# EAGLE schematic 202405272 (EAGLE 6.6.0)

## Sheet 1 of 3
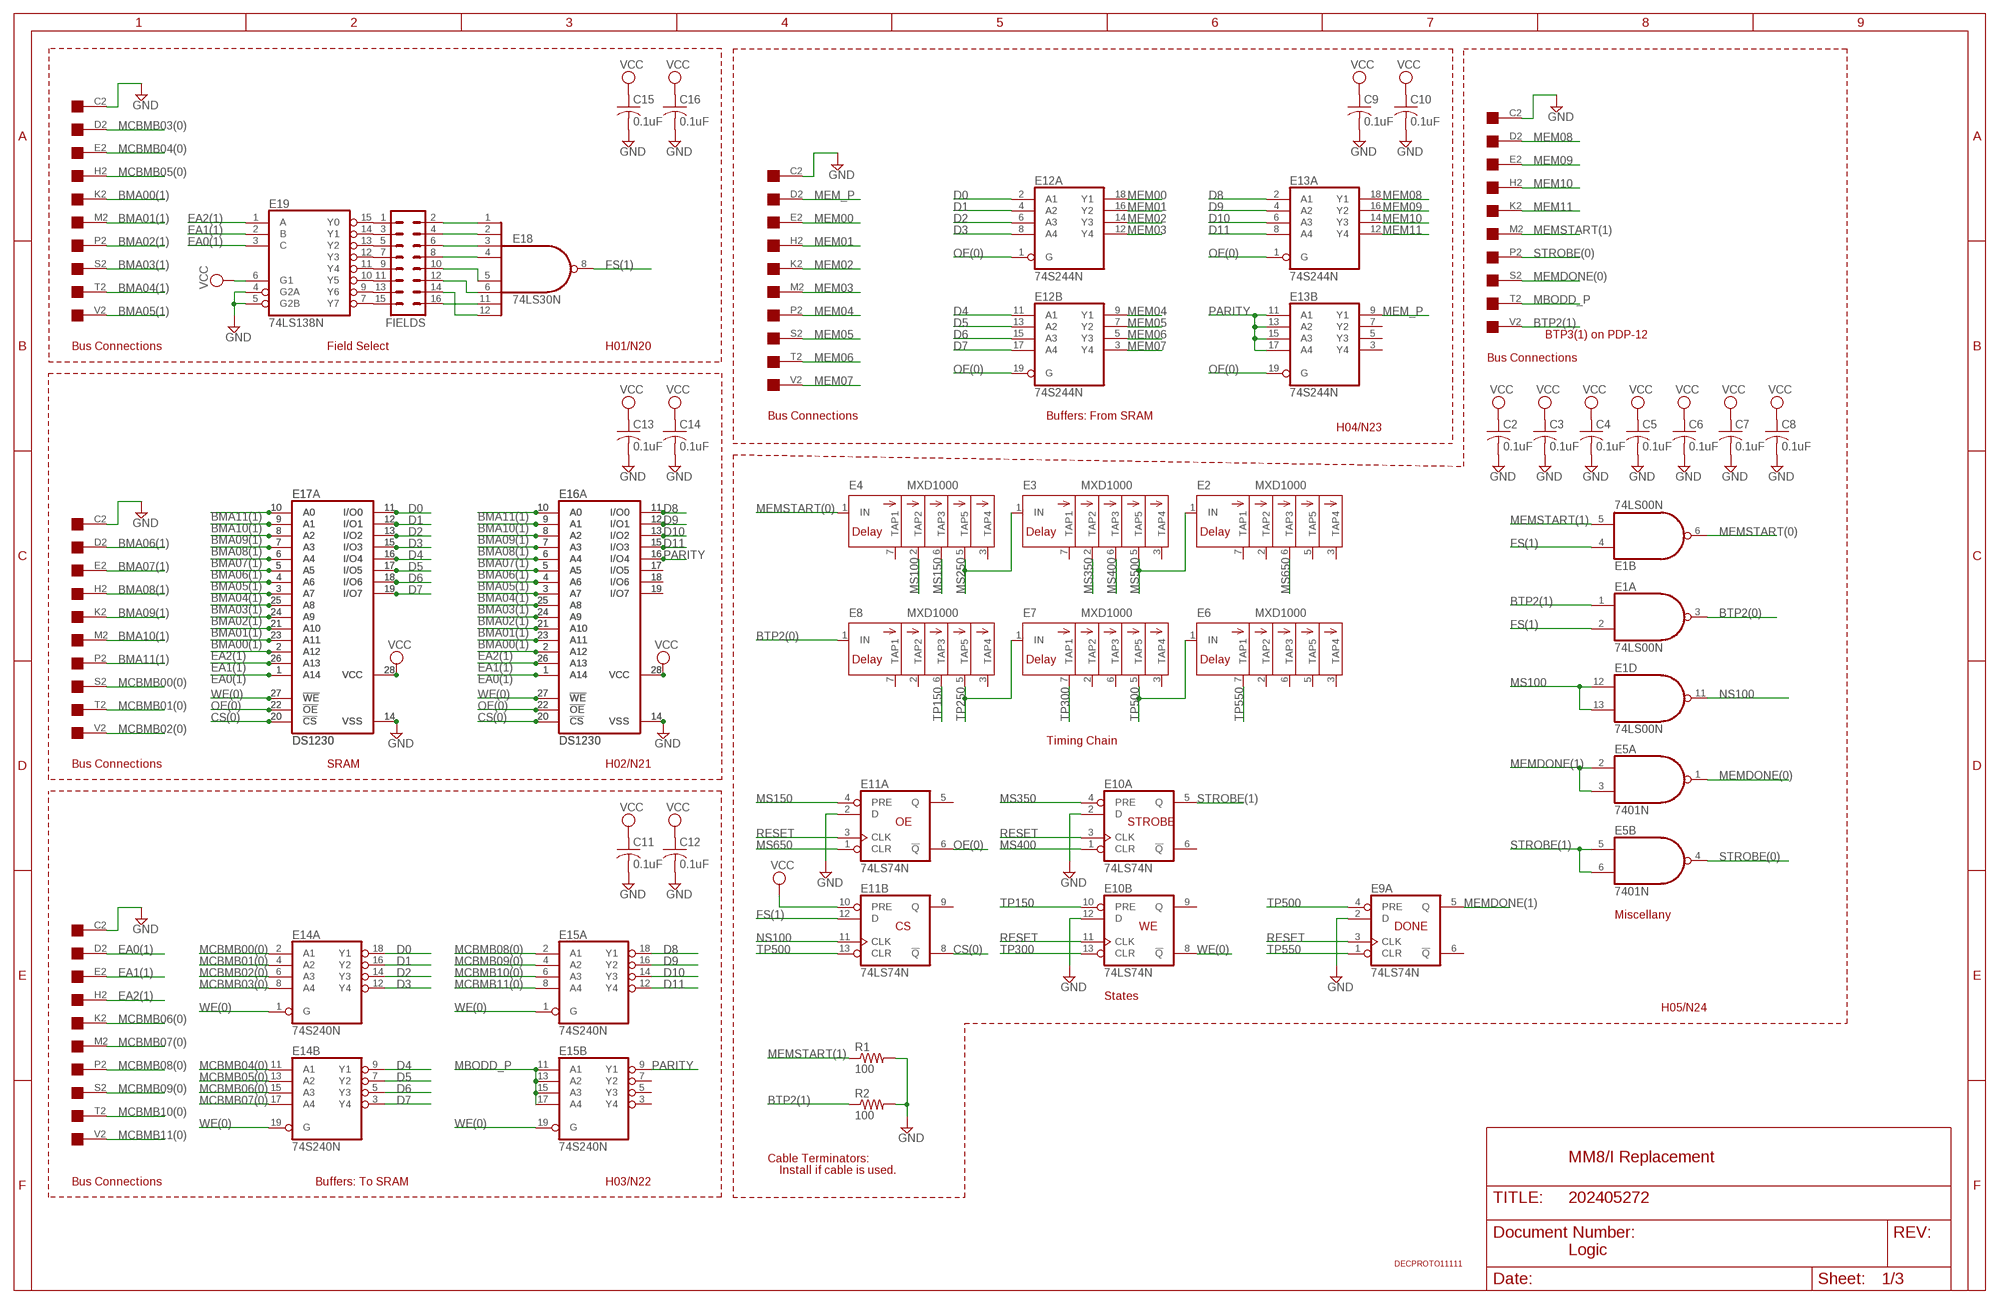
[diagram p0: schematic, sheet 1]

### Parts
C2  0.1uF  C-US050-025X075  [C050-025X075]
C3  0.1uF  C-US050-025X075  [C050-025X075]
C4  0.1uF  C-US050-025X075  [C050-025X075]
C5  0.1uF  C-US050-025X075  [C050-025X075]
C6  0.1uF  C-US050-025X075  [C050-025X075]
C7  0.1uF  C-US050-025X075  [C050-025X075]
C8  0.1uF  C-US050-025X075  [C050-025X075]
C9  0.1uF  C-US050-025X075  [C050-025X075]
C10  0.1uF  C-US050-025X075  [C050-025X075]
C11  0.1uF  C-US050-025X075  [C050-025X075]
C12  0.1uF  C-US050-025X075  [C050-025X075]
C13  0.1uF  C-US050-025X075  [C050-025X075]
C14  0.1uF  C-US050-025X075  [C050-025X075]
C15  0.1uF  C-US050-025X075  [C050-025X075]
C16  0.1uF  C-US050-025X075  [C050-025X075]
E1  74LS00N  [DIL14]
E2  MXD1000  [DIL08]
E3  MXD1000  [DIL08]
E4  MXD1000  [DIL08]
E5  7401N  74LS01N  [DIL14]
E6  MXD1000  [DIL08]
E7  MXD1000  [DIL08]
E8  MXD1000  [DIL08]
E9  74LS74N  [DIL14]
E10  74LS74N  [DIL14]
E11  74LS74N  [DIL14]
E12  74S244N  [DIL20]
E13  74S244N  [DIL20]
E14  74S240N  [DIL20]
E15  74S240N  [DIL20]
E16  DS1230  62256P  [DIL28-6]
E16A  DS1230  62832P  [DIL28-3]
E17  DS1230  62256P  [DIL28-6]
E17A  DS1230  62832P  [DIL28-3]
E18  74LS30N  [DIL14]
E19  74LS138N  [DIL16]
FIELDS  MA08-2  [MA08-2]
H01  EDGE-1  [EDGE-CON1]
H02  EDGE-1  [EDGE-CON1]
H03  EDGE-1  [EDGE-CON1]
H04  EDGE-1  [EDGE-CON1]
H05  EDGE-1  [EDGE-CON1]
R1  100  R-US_0207/10  [0207/10]
R2  100  R-US_0207/10  [0207/10]
U$6  DECPROTO11111  [DECPROTO11111]

### Nets
BMA00(1): E16.23(A11) E16A.23(A11) E17.23(A11) E17A.23(A11) H01.K2 ; also sheet 2
BMA01(1): E16.21(A10) E16A.21(A10) E17.21(A10) E17A.21(A10) H01.M2 ; also sheet 2
BMA02(1): E16.24(A9) E16A.24(A9) E17.24(A9) E17A.24(A9) H01.P2 ; also sheet 2
BMA03(1): E16.25(A8) E16A.25(A8) E17.25(A8) E17A.25(A8) H01.S2 ; also sheet 2
BMA04(1): E16.3(A7) E16A.3(A7) E17.3(A7) E17A.3(A7) H01.T2 ; also sheet 2
BMA05(1): E16.4(A6) E16A.4(A6) E17.4(A6) E17A.4(A6) H01.V2 ; also sheet 2
BMA06(1): E16.5(A5) E16A.5(A5) E17.5(A5) E17A.5(A5) H02.D2 ; also sheet 2
BMA07(1): E16.6(A4) E16A.6(A4) E17.6(A4) E17A.6(A4) H02.E2 ; also sheet 2
BMA08(1): E16.7(A3) E16A.7(A3) E17.7(A3) E17A.7(A3) H02.H2 ; also sheet 2
BMA09(1): E16.8(A2) E16A.8(A2) E17.8(A2) E17A.8(A2) H02.K2 ; also sheet 2
BMA10(1): E16.9(A1) E16A.9(A1) E17.9(A1) E17A.9(A1) H02.M2 ; also sheet 2
BMA11(1): E16.10(A0) E16A.10(A0) E17.10(A0) E17A.10(A0) H02.P2 ; also sheet 2
BTP2(0): E1.3(A:O) E8.1(IN)
BTP2(1): E1.1(A:I0) H05.V2 R2.1
CS(0): E11.8(B:!Q) E16.20(!CS) E16A.20(!CS) E17.20(!CS) E17A.20(!CS) ; also sheet 2
D0: E12.2(A:A1) E14.18(A:Y1) E17.11(I/O0) E17A.11(I/O0) ; also sheet 2
D1: E12.4(A:A2) E14.16(A:Y2) E17.12(I/O1) E17A.12(I/O1) ; also sheet 2
D2: E12.6(A:A3) E14.14(A:Y3) E17.13(I/O2) E17A.13(I/O2) ; also sheet 2
D3: E12.8(A:A4) E14.12(A:Y4) E17.15(I/O3) E17A.15(I/O3) ; also sheet 2
D4: E12.11(B:A1) E14.9(B:Y1) E17.16(I/O4) E17A.16(I/O4) ; also sheet 2
D5: E12.13(B:A2) E14.7(B:Y2) E17.17(I/O5) E17A.17(I/O5) ; also sheet 2
D6: E12.15(B:A3) E14.5(B:Y3) E17.18(I/O6) E17A.18(I/O6) ; also sheet 2
D7: E12.17(B:A4) E14.3(B:Y4) E17.19(I/O7) E17A.19(I/O7) ; also sheet 2
D8: E13.2(A:A1) E15.18(A:Y1) E16.11(I/O0) E16A.11(I/O0) ; also sheet 2
D9: E13.4(A:A2) E15.16(A:Y2) E16.12(I/O1) E16A.12(I/O1) ; also sheet 2
D10: E13.6(A:A3) E15.14(A:Y3) E16.13(I/O2) E16A.13(I/O2) ; also sheet 2
D11: E13.8(A:A4) E15.12(A:Y4) E16.15(I/O3) E16A.15(I/O3) ; also sheet 2
EA0(1): E16.1(A14) E16A.1(A14) E17.1(A14) E17A.1(A14) E19.3(C) H03.D2 ; also sheet 2
EA1(1): E16.26(A13) E16A.26(A13) E17.26(A13) E17A.26(A13) E19.2(B) H03.E2 ; also sheet 2
EA2(1): E16.2(A12) E16A.2(A12) E17.2(A12) E17A.2(A12) E19.1(A) H03.H2 ; also sheet 2
FS(1): E1.2(A:I1) E1.4(B:I0) E11.12(B:D) E18.8(O) ; also sheet 2
GND [supply]: C2.2 C3.2 C4.2 C5.2 C6.2 C7.2 C8.2 C9.2 C10.2 C11.2 C12.2 C13.2 C14.2 C15.2 C16.2 E9.2(A:D) E10.2(A:D) E10.12(B:D) E11.2(A:D) E16.14(VSS) E16A.14(VSS) E17.14(VSS) E17A.14(VSS) E19.4(G2A) E19.5(G2B) H01.C2 H02.C2 H03.C2 H04.C2 H05.C2 R1.2 R2.2 ; also sheet 2
MBODD_P: E15.11(B:A1) E15.13(B:A2) E15.15(B:A3) E15.17(B:A4) H05.T2 ; also sheet 2
MCBMB00(0): E14.2(A:A1) H02.S2 ; also sheet 2
MCBMB01(0): E14.4(A:A2) H02.T2 ; also sheet 2
MCBMB02(0): E14.6(A:A3) H02.V2 ; also sheet 2
MCBMB03(0): E14.8(A:A4) H01.D2 ; also sheet 2
MCBMB04(0): E14.11(B:A1) H01.E2 ; also sheet 2
MCBMB05(0): E14.13(B:A2) H01.H2 ; also sheet 2
MCBMB06(0): E14.15(B:A3) H03.K2
MCBMB07(0): E14.17(B:A4) H03.M2
MCBMB08(0): E15.2(A:A1) H03.P2
MCBMB09(0): E15.4(A:A2) H03.S2
MCBMB10(0): E15.6(A:A3) H03.T2
MCBMB11(0): E15.8(A:A4) H03.V2
MEM00: E12.18(A:Y1) H04.E2
MEM01: E12.16(A:Y2) H04.H2
MEM02: E12.14(A:Y3) H04.K2
MEM03: E12.12(A:Y4) H04.M2
MEM04: E12.9(B:Y1) H04.P2
MEM05: E12.7(B:Y2) H04.S2
MEM06: E12.5(B:Y3) H04.T2
MEM07: E12.3(B:Y4) H04.V2
MEM08: E13.18(A:Y1) H05.D2 ; also sheet 2
MEM09: E13.16(A:Y2) H05.E2 ; also sheet 2
MEM10: E13.14(A:Y3) H05.H2 ; also sheet 2
MEM11: E13.12(A:Y4) H05.K2 ; also sheet 2
MEM_P: E13.9(B:Y1) H04.D2
MEMDONE(0): E5.1(A:O) H05.S2
MEMDONE(1): E5.2(A:I0) E5.3(A:I1) E9.5(A:Q)
MEMSTART(0): E1.6(B:O) E4.1(IN) ; also sheet 2
MEMSTART(1): E1.5(B:I1) H05.M2 R1.1
MS100: E1.12(D:I0) E1.13(D:I1) E4.2(TAP2)
MS150: E4.6(TAP3) E11.4(A:PRE)
MS250: E3.1(IN) E4.5(TAP5)
MS350: E3.2(TAP2) E10.4(A:PRE)
MS400: E3.6(TAP3) E10.1(A:CLR)
MS500: E2.1(IN) E3.5(TAP5)
MS650: E2.6(TAP3) E11.1(A:CLR)
N$2: E16.17(I/O5) E16A.17(I/O5)
N$3: E16.18(I/O6) E16A.18(I/O6)
N$4: E16.19(I/O7) E16A.19(I/O7)
N$18: E19.15(Y0) FIELDS.1
N$19: E19.14(Y1) FIELDS.3
N$20: E19.13(Y2) FIELDS.5
N$21: E19.12(Y3) FIELDS.7
N$22: E19.11(Y4) FIELDS.9
N$23: E19.10(Y5) FIELDS.11
N$24: E19.9(Y6) FIELDS.13
N$25: E19.7(Y7) FIELDS.15
N$26: E18.4(I3) FIELDS.8
N$27: E18.3(I2) FIELDS.6
N$28: E18.2(I1) FIELDS.4
N$29: E18.1(I0) FIELDS.2
N$30: E18.5(I4) FIELDS.10
N$31: E18.6(I5) FIELDS.12
N$32: E18.12(I7) FIELDS.14
N$33: E18.11(I6) FIELDS.16
NS100: E1.11(D:O) E11.11(B:CLK)
OE(0): E11.6(A:!Q) E12.1(A:G) E12.19(B:G) E13.1(A:G) E13.19(B:G) E16.22(!OE) E16A.22(!OE) E17.22(!OE) E17A.22(!OE) ; also sheet 2
PARITY: E13.11(B:A1) E13.13(B:A2) E13.15(B:A3) E13.17(B:A4) E15.9(B:Y1) E16.16(I/O4) E16A.16(I/O4) ; also sheet 2
RESET: E9.3(A:CLK) E10.3(A:CLK) E10.11(B:CLK) E11.3(A:CLK) ; also sheet 2
STROBE(0): E5.4(B:O) H05.P2
STROBE(1): E5.5(B:I0) E5.6(B:I1) E10.5(A:Q)
TP150: E8.6(TAP3) E10.10(B:PRE)
TP250: E7.1(IN) E8.5(TAP5)
TP300: E7.7(TAP1) E10.13(B:CLR)
TP500: E6.1(IN) E7.5(TAP5) E9.4(A:PRE) E11.13(B:CLR)
TP550: E6.7(TAP1) E9.1(A:CLR)
VCC [supply]: C2.1 C3.1 C4.1 C5.1 C6.1 C7.1 C8.1 C9.1 C10.1 C11.1 C12.1 C13.1 C14.1 C15.1 C16.1 E11.10(B:PRE) E16.28(VCC) E16A.28(VCC) E17.28(VCC) E17A.28(VCC) E19.6(G1) ; also sheet 2
WE(0): E10.8(B:!Q) E14.1(A:G) E14.19(B:G) E15.1(A:G) E15.19(B:G) E16.27(!WE) E16A.27(!WE) E17.27(!WE) E17A.27(!WE) ; also sheet 2
Unconnected: E2.2(TAP2) E2.3(TAP4) E2.5(TAP5) E2.7(TAP1) E3.3(TAP4) E3.7(TAP1) E4.3(TAP4) E4.7(TAP1) E6.2(TAP2) E6.3(TAP4) E6.5(TAP5) E6.6(TAP3) E7.2(TAP2) E7.3(TAP4) E7.6(TAP3) E8.2(TAP2) E8.3(TAP4) E8.7(TAP1) E9.6(A:!Q) E10.6(A:!Q) E10.9(B:Q) E11.5(A:Q) E11.9(B:Q) E13.3(B:Y4) E13.5(B:Y3) E13.7(B:Y2) E15.3(B:Y4) E15.5(B:Y3) E15.7(B:Y2) H01.A2 H01.B2 H01.F2 H01.J2 H01.L2 H01.N2 H01.R2 H01.U2 H02.A2 H02.B2 H02.F2 H02.J2 H02.L2 H02.N2 H02.R2 H02.U2 H03.A2 H03.B2 H03.F2 H03.J2 H03.L2 H03.N2 H03.R2 H03.U2 H04.A2 H04.B2 H04.F2 H04.J2 H04.L2 H04.N2 H04.R2 H04.U2 H05.A2 H05.B2 H05.F2 H05.J2 H05.L2 H05.N2 H05.R2 H05.U2

### Notes on the sheet
- BTP3(1) on PDP-12
- Bus Connections | Field Select | H01/N20
- Bus Connections
- Bus Connections | Buffers: From SRAM
- H04/N23
- Timing Chain
- Bus Connections | SRAM | H02/N21
- OE | STROBE
- Miscellany
- CS | WE | DONE
- States
- H05/N24
- Cable Terminators: | MM8/I Replacement
- Install if cable is used.
- Bus Connections | Buffers: To SRAM | H03/N22
- Logic

## Sheet 2 of 3
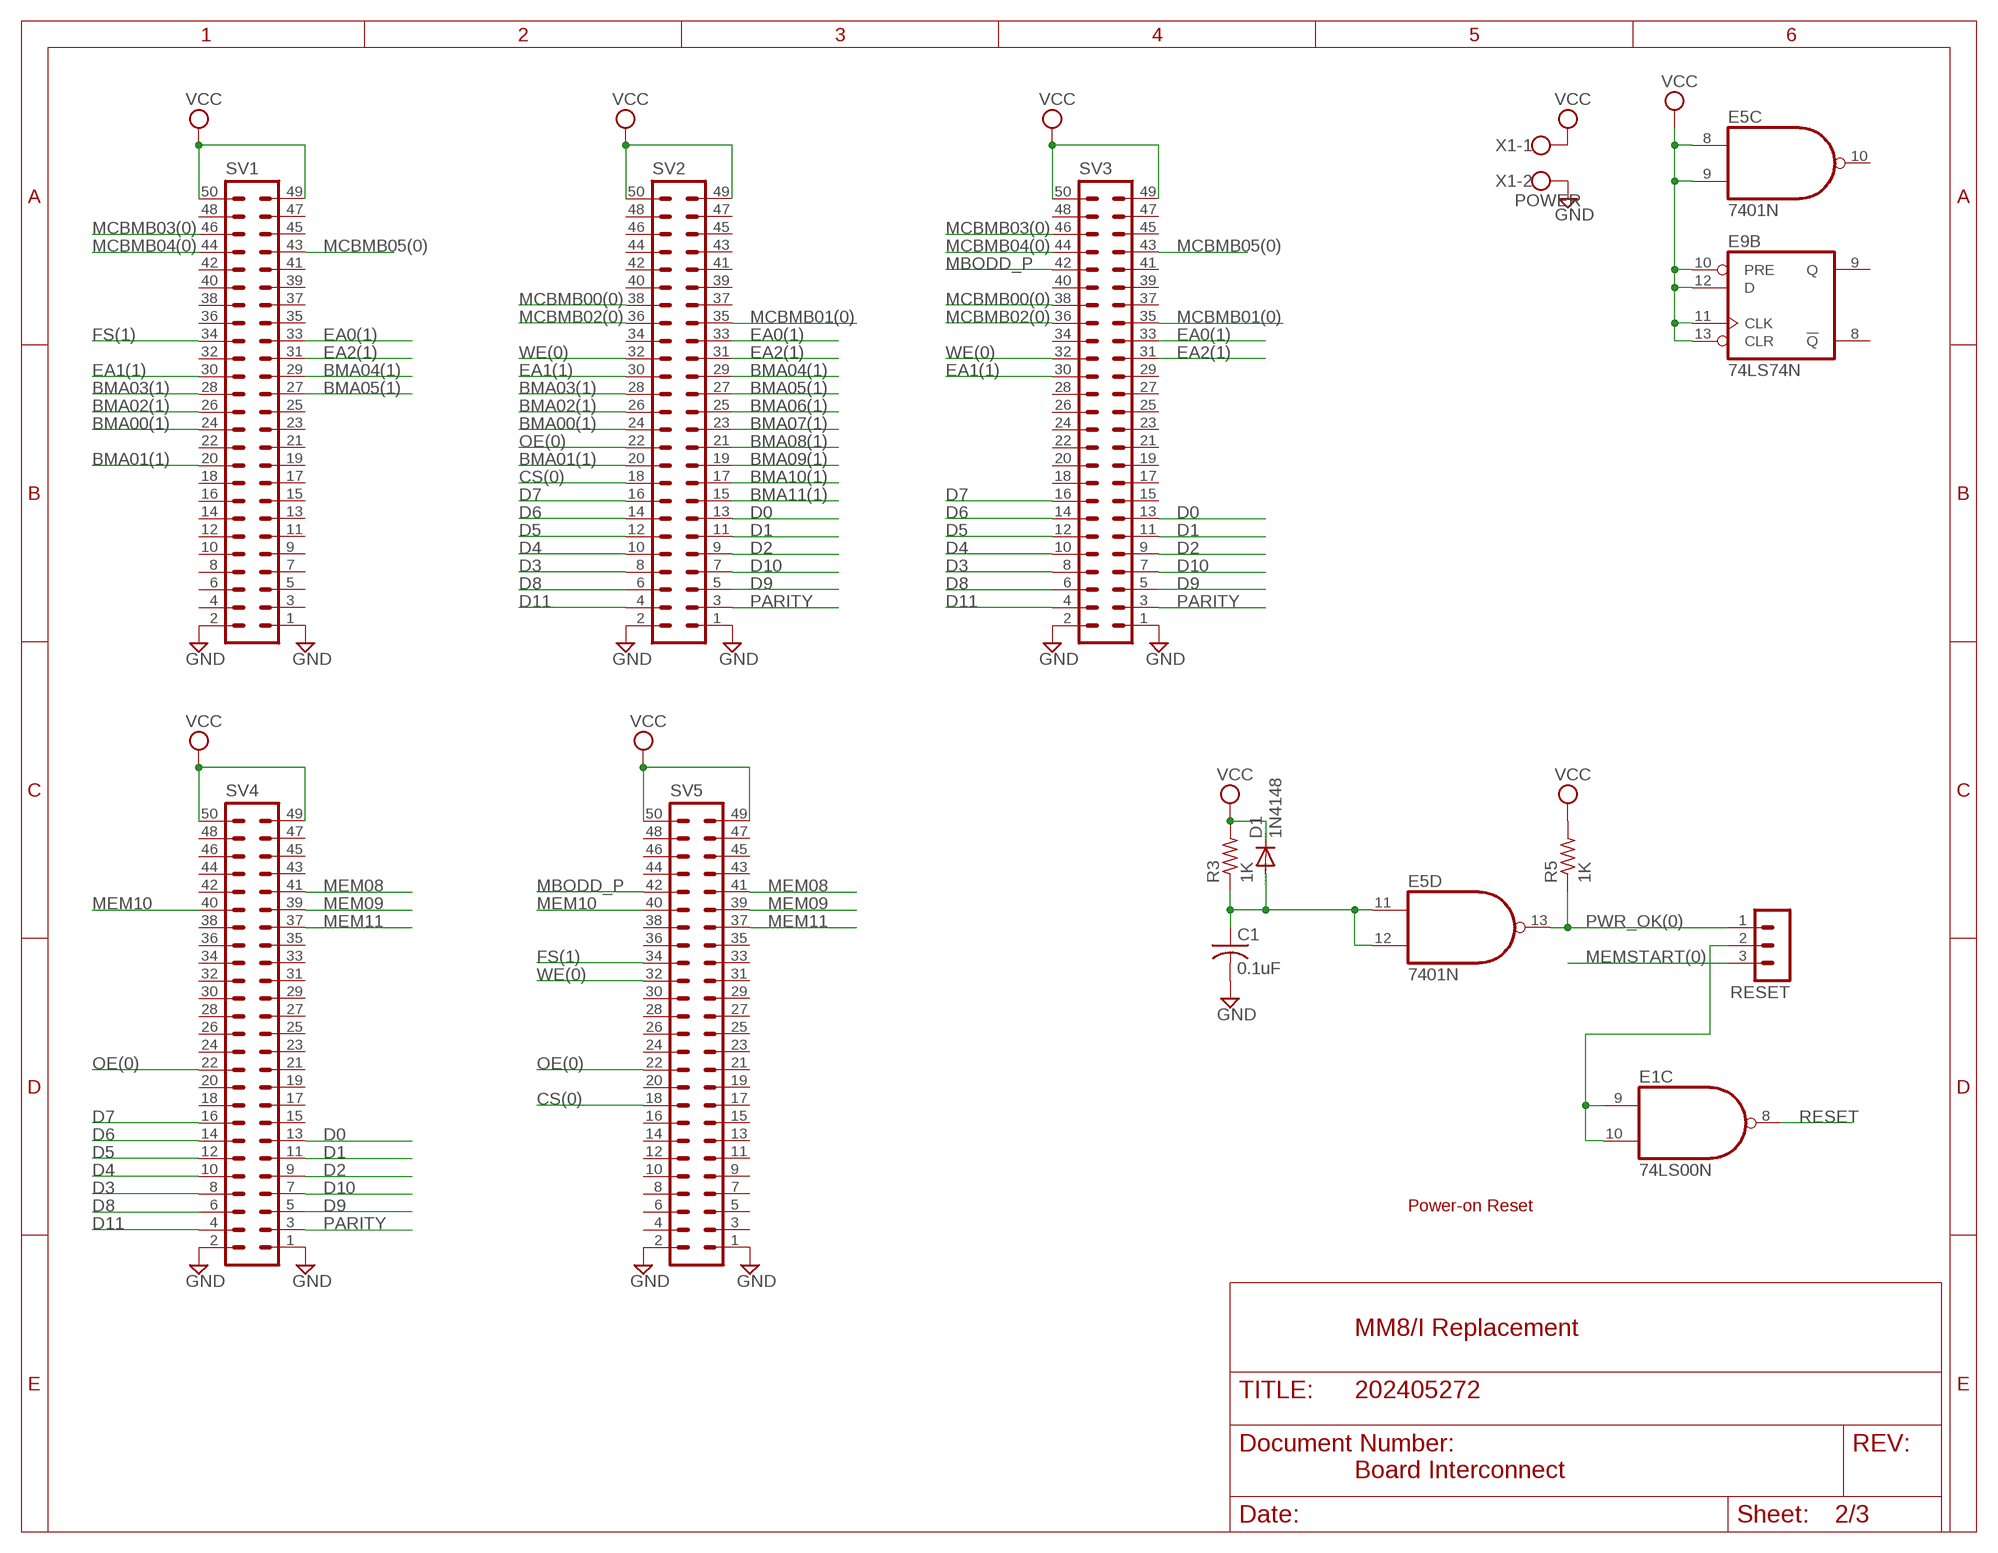
[diagram p1: schematic, sheet 2]

### Parts
C1  0.1uF  C-US050-025X075  [C050-025X075]
D1  1N4148  1N4148DO35-10  [DO35-10]
R3  1K  R-US_0207/10  [0207/10]
R5  1K  R-US_0207/10  [0207/10]
RESET  MA03-1  [MA03-1]
SV1  ML50L  [ML50L]
SV2  ML50L  [ML50L]
SV3  ML50L  [ML50L]
SV4  ML50L  [ML50L]
SV5  ML50L  [ML50L]
X1  POWER  W237-102  [W237-102]

### Nets
BMA00(1): SV1.24 SV2.24 ; also sheet 1
BMA01(1): SV1.20 SV2.20 ; also sheet 1
BMA02(1): SV1.26 SV2.26 ; also sheet 1
BMA03(1): SV1.28 SV2.28 ; also sheet 1
BMA04(1): SV1.29 SV2.29 ; also sheet 1
BMA05(1): SV1.27 SV2.27 ; also sheet 1
BMA06(1): SV2.25 ; also sheet 1
BMA07(1): SV2.23 ; also sheet 1
BMA08(1): SV2.21 ; also sheet 1
BMA09(1): SV2.19 ; also sheet 1
BMA10(1): SV2.17 ; also sheet 1
BMA11(1): SV2.15 ; also sheet 1
CS(0): SV2.18 SV5.18 ; also sheet 1
D0: SV2.13 SV3.13 SV4.13 ; also sheet 1
D1: SV2.11 SV3.11 SV4.11 ; also sheet 1
D2: SV2.9 SV3.9 SV4.9 ; also sheet 1
D3: SV2.8 SV3.8 SV4.8 ; also sheet 1
D4: SV2.10 SV3.10 SV4.10 ; also sheet 1
D5: SV2.12 SV3.12 SV4.12 ; also sheet 1
D6: SV2.14 SV3.14 SV4.14 ; also sheet 1
D7: SV2.16 SV3.16 SV4.16 ; also sheet 1
D8: SV2.6 SV3.6 SV4.6 ; also sheet 1
D9: SV2.5 SV3.5 SV4.5 ; also sheet 1
D10: SV2.7 SV3.7 SV4.7 ; also sheet 1
D11: SV2.4 SV3.4 SV4.4 ; also sheet 1
EA0(1): SV1.33 SV2.33 SV3.33 ; also sheet 1
EA1(1): SV1.30 SV2.30 SV3.30 ; also sheet 1
EA2(1): SV1.31 SV2.31 SV3.31 ; also sheet 1
FS(1): SV1.34 SV5.34 ; also sheet 1
GND [supply]: C1.2 SV1.1 SV1.2 SV2.1 SV2.2 SV3.1 SV3.2 SV4.1 SV4.2 SV5.1 SV5.2 X1.2 ; also sheet 1
MBODD_P: SV3.42 SV5.42 ; also sheet 1
MCBMB00(0): SV2.38 SV3.38 ; also sheet 1
MCBMB01(0): SV2.35 SV3.35 ; also sheet 1
MCBMB02(0): SV2.36 SV3.36 ; also sheet 1
MCBMB03(0): SV1.46 SV3.46 ; also sheet 1
MCBMB04(0): SV1.44 SV3.44 ; also sheet 1
MCBMB05(0): SV1.43 SV3.43 ; also sheet 1
MEM08: SV4.41 SV5.41 ; also sheet 1
MEM09: SV4.39 SV5.39 ; also sheet 1
MEM10: SV4.40 SV5.40 ; also sheet 1
MEM11: SV4.37 SV5.37 ; also sheet 1
MEMSTART(0): RESET.3 ; also sheet 1
N$1: E1.9(C:I0) E1.10(C:I1) RESET.2
OE(0): SV2.22 SV4.22 SV5.22 ; also sheet 1
PARITY: SV2.3 SV3.3 SV4.3 ; also sheet 1
PWR_OK: C1.1 D1.A E5.11(D:I0) E5.12(D:I1) R3.1
PWR_OK(0): E5.13(D:O) R5.1 RESET.1
RESET: E1.8(C:O) ; also sheet 1
VCC [supply]: D1.C E5.8(C:I0) E5.9(C:I1) E9.10(B:PRE) E9.11(B:CLK) E9.12(B:D) E9.13(B:CLR) R3.2 R5.2 SV1.49 SV1.50 SV2.49 SV2.50 SV3.49 SV3.50 SV4.49 SV4.50 SV5.49 SV5.50 X1.1 ; also sheet 1
WE(0): SV2.32 SV3.32 SV5.32 ; also sheet 1
Unconnected: E5.10(C:O) E9.8(B:!Q) E9.9(B:Q) SV1.3 SV1.4 SV1.5 SV1.6 SV1.7 SV1.8 SV1.9 SV1.10 SV1.11 SV1.12 SV1.13 SV1.14 SV1.15 SV1.16 SV1.17 SV1.18 SV1.19 SV1.21 SV1.22 SV1.23 SV1.25 SV1.32 SV1.35 SV1.36 SV1.37 SV1.38 SV1.39 SV1.40 SV1.41 SV1.42 SV1.45 SV1.47 SV1.48 SV2.34 SV2.37 SV2.39 SV2.40 SV2.41 SV2.42 SV2.43 SV2.44 SV2.45 SV2.46 SV2.47 SV2.48 SV3.15 SV3.17 SV3.18 SV3.19 SV3.20 SV3.21 SV3.22 SV3.23 SV3.24 SV3.25 SV3.26 SV3.27 SV3.28 SV3.29 SV3.34 SV3.37 SV3.39 SV3.40 SV3.41 SV3.45 SV3.47 SV3.48 SV4.15 SV4.17 SV4.18 SV4.19 SV4.20 SV4.21 SV4.23 SV4.24 SV4.25 SV4.26 SV4.27 SV4.28 SV4.29 SV4.30 SV4.31 SV4.32 SV4.33 SV4.34 SV4.35 SV4.36 SV4.38 SV4.42 SV4.43 SV4.44 SV4.45 SV4.46 SV4.47 SV4.48 SV5.3 SV5.4 SV5.5 SV5.6 SV5.7 SV5.8 SV5.9 SV5.10 SV5.11 SV5.12 SV5.13 SV5.14 SV5.15 SV5.16 SV5.17 SV5.19 SV5.20 SV5.21 SV5.23 SV5.24 SV5.25 SV5.26 SV5.27 SV5.28 SV5.29 SV5.30 SV5.31 SV5.33 SV5.35 SV5.36 SV5.38 SV5.43 SV5.44 SV5.45 SV5.46 SV5.47 SV5.48

### Notes on the sheet
- Power-on Reset
- MM8/I Replacement
- Board Interconnect

## Sheet 3 of 3
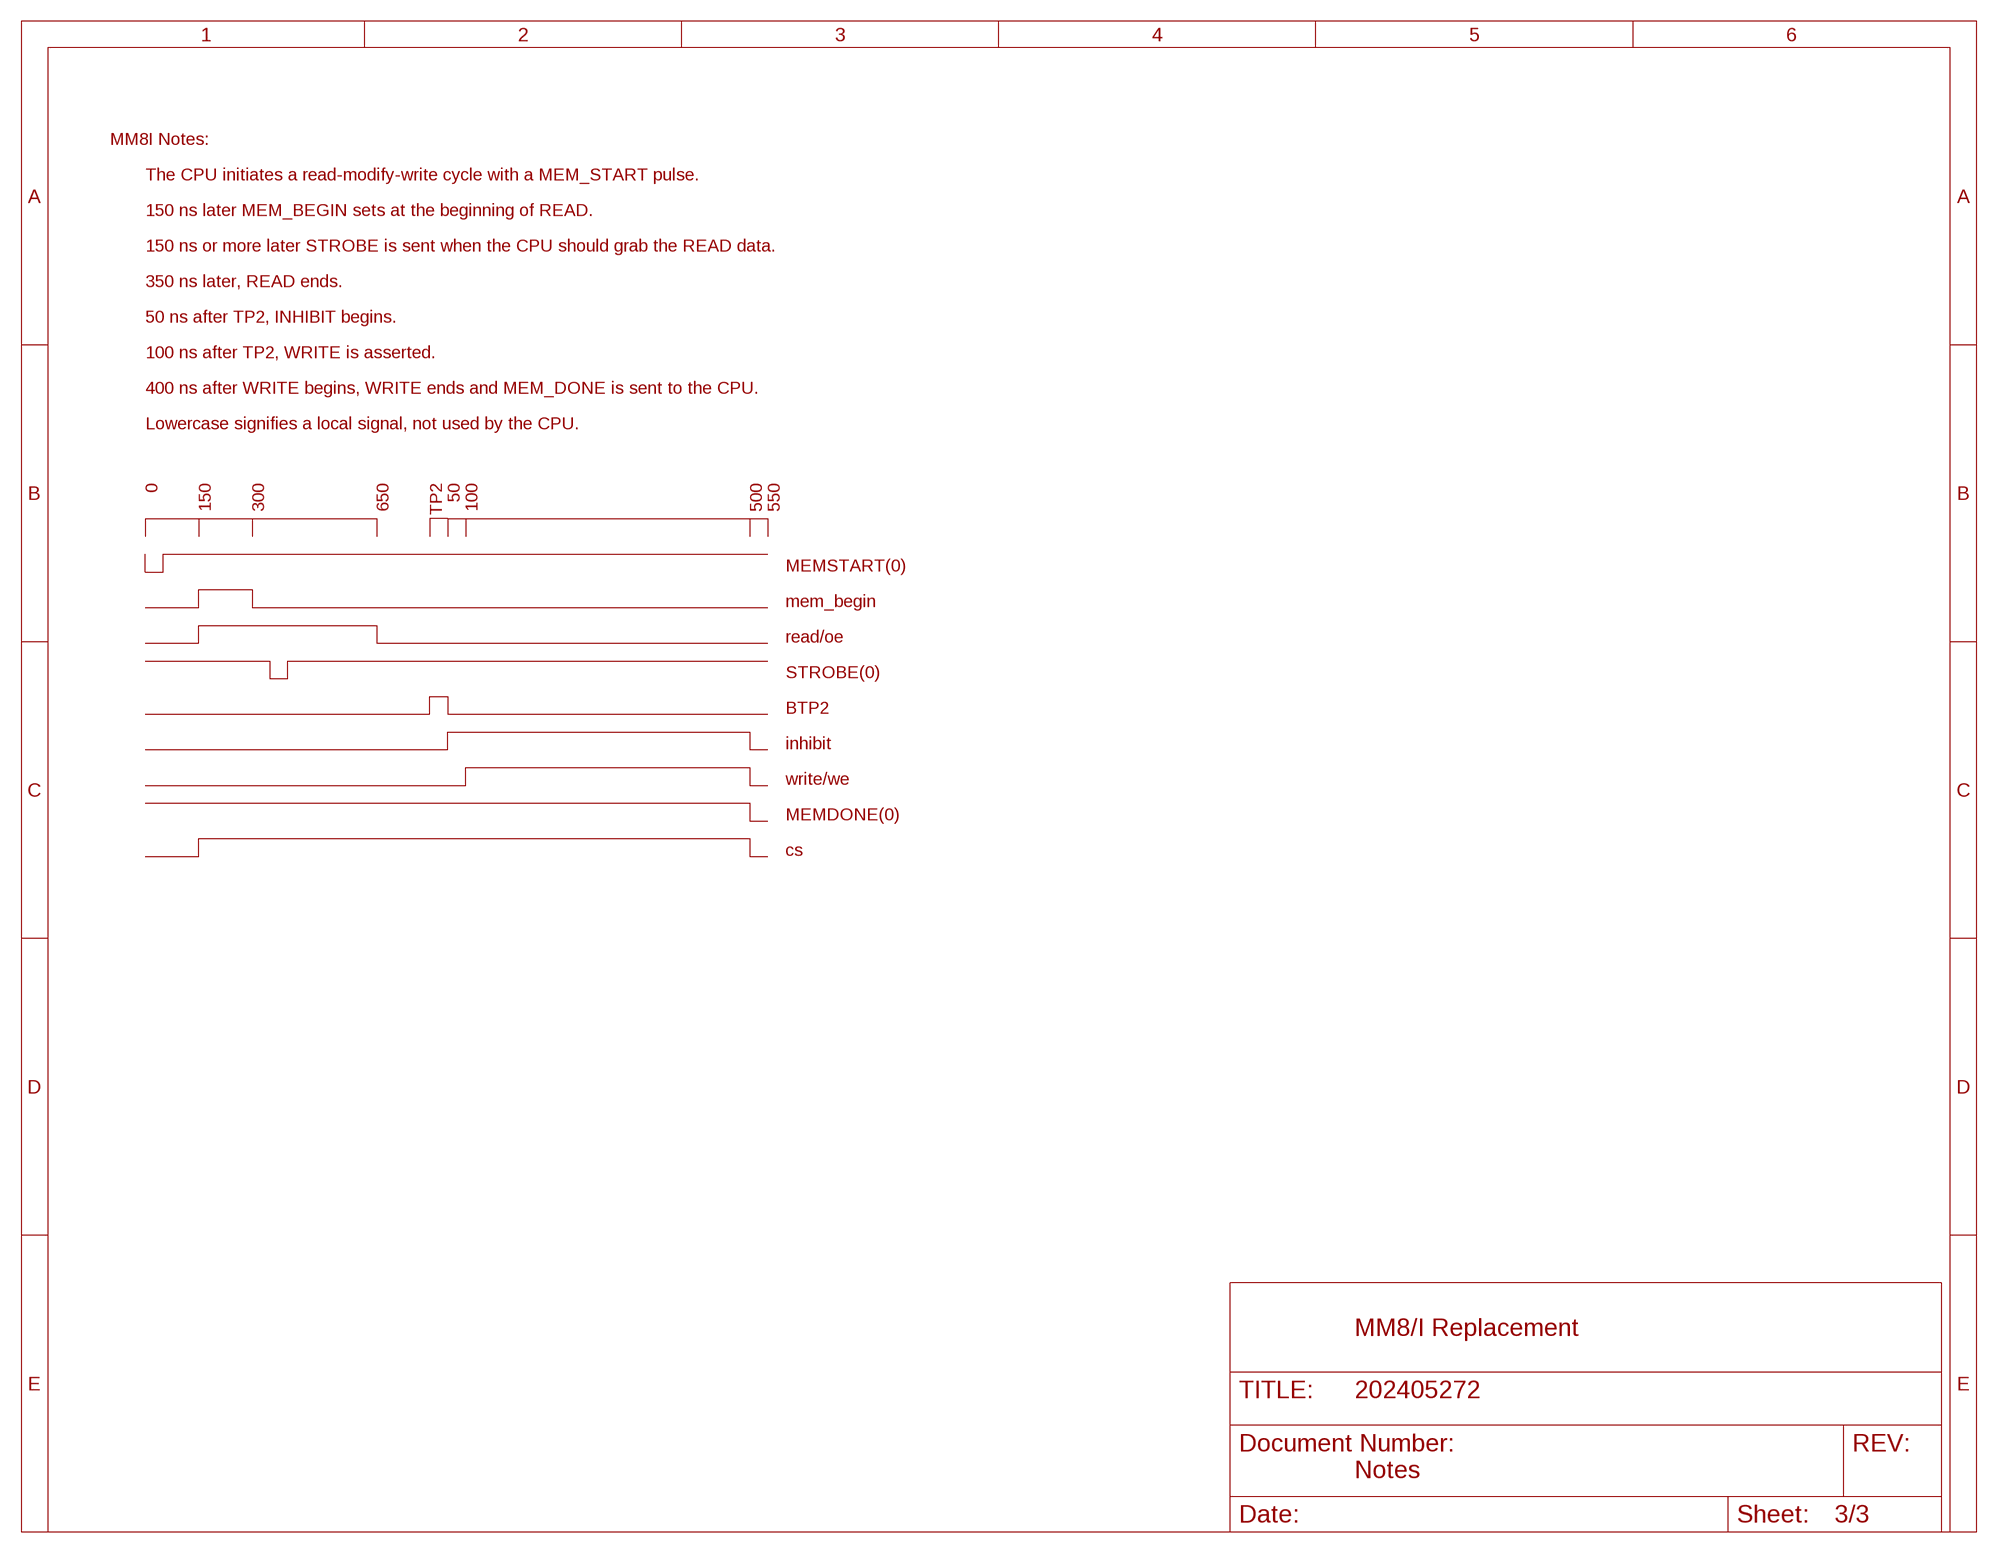
[diagram p2: schematic, sheet 3]

### Notes on the sheet
- MM8I Notes:
- The CPU initiates a read-modify-write cycle with a MEM_START pulse.
- 150 ns later MEM_BEGIN sets at the beginning of READ.
- 150 ns or more later STROBE is sent when the CPU should grab the READ data.
- 350 ns later, READ ends.
- 50 ns after TP2, INHIBIT begins.
- 100 ns after TP2, WRITE is asserted.
- 400 ns after WRITE begins, WRITE ends and MEM_DONE is sent to the CPU.
- Lowercase signifies a local signal, not used by the CPU.
- 0 | 150 | 300 | 650 | TP2 | 50 | 100 | 500 | 550
- MEMSTART(0)
- mem_begin
- read/oe
- STROBE(0)
- BTP2
- inhibit
- write/we
- MEMDONE(0)
- cs
- MM8/I Replacement
- Notes

## Power pins joined to a net without a drawn wire
GND: E1.7(P:GND) E2.4(GND) E3.4(GND) E4.4(GND) E5.7(P:GND) E6.4(GND) E7.4(GND) E8.4(GND) E9.7(P:GND) E10.7(P:GND) E11.7(P:GND) E12.10(P:GND) E13.10(P:GND) E14.10(P:GND) E15.10(P:GND) E18.7(GND) E19.8(GND)
VCC: E1.14(P:VCC) E2.8(VCC) E3.8(VCC) E4.8(VCC) E5.14(P:VCC) E6.8(VCC) E7.8(VCC) E8.8(VCC) E9.14(P:VCC) E10.14(P:VCC) E11.14(P:VCC) E12.20(P:VCC) E13.20(P:VCC) E14.20(P:VCC) E15.20(P:VCC) E18.14(VCC) E19.16(VCC)

## Library data of the parts
C1-C16 = rcl:C-US: CAPACITOR, American symbol
D1 = diode:1N4148: DIODE high speed (Philips)
E1 = 74xx-us:74*00: Quad 2-input NAND gate
E2-E4 E6-E8 = maxim:MXD1000: DELAY LINE; OC_FARNELL: unknown; OC_NEWARK: unknown
E5 = 74xx-us:74*01: Quad 2-input NAND gate, open collector
E9-E11 = 74xx-us:74*74: Dual D type positive edge triggered FLIP FLOP, preset and clear
E12 E13 = 74xx-us:74*244: Octal BUFFER and LINE DRIVER, 3-state
E14 E15 = 74xx-us:74*240: Octal BUFFER and LINE DRIVER, 3-state
E16 E17 = memory-hitachi:62256P: MEMORY; OC_FARNELL: unknown; OC_NEWARK: unknown
E16A E17A = memory-hitachi:62832P: MEMORY; OC_FARNELL: unknown; OC_NEWARK: unknown
E18 = 74xx-us:74*30: 8-input NAND gate
E19 = 74xx-us:74*138: 3-line to 8-line DECODER/DEMULTIPLEXER
FIELDS = con-lstb:MA08-2: PIN HEADER; OC_FARNELL: unknown; OC_NEWARK: unknown
H01-H05 = dec-con:EDGE-1: Single-Sided DEC Edge Connector -- (side 2)
R1-R3 R5 = rcl:R-US_: RESISTOR, American symbol
RESET = con-lstb:MA03-1: PIN HEADER; OC_FARNELL: unknown; OC_NEWARK: unknown
SV1-SV5 = con-ml:ML50L: HARTING; OC_FARNELL: unknown; OC_NEWARK: unknown
U$6 = dec-con:DECPROTO: Various small DEC boards stuck together with break-away tab routing.
X1 = con-wago-500:W237-102: WAGO SCREW CLAMP; MPN: 237-102; OC_FARNELL: unknown; OC_NEWARK: 70K9898

## Net classes
1 supply: width 0.711 mm